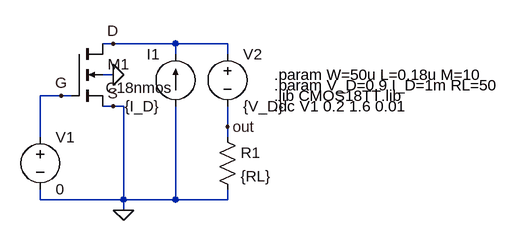
[diagram p0: schematic NMOS-DriveCapability-testbench.asc]
NMOS-DriveCapability-testbench.asc, the LTspice schematic file:
Version 4
SHEET 1 880 680
WIRE 80 48 64 48
WIRE 176 48 80 48
WIRE 256 48 176 48
WIRE 176 64 176 48
WIRE 256 64 256 48
WIRE 80 96 64 96
WIRE 0 128 -32 128
WIRE 16 128 0 128
WIRE 80 144 64 144
WIRE 96 144 80 144
WIRE 256 176 256 144
WIRE -32 192 -32 128
WIRE 256 192 256 176
WIRE -32 288 -32 272
WIRE 96 288 96 144
WIRE 96 288 -32 288
WIRE 176 288 176 144
WIRE 176 288 96 288
WIRE 256 288 256 272
WIRE 256 288 176 288
WIRE 96 304 96 288
FLAG 96 304 0
FLAG 80 96 0
FLAG 0 128 G
FLAG 80 144 S
FLAG 80 48 D
FLAG 256 176 out
SYMBOL nmos4 16 48 R0
WINDOW 3 53 68 Left 2
SYMATTR Value C18nmos
SYMATTR InstName M1
SYMATTR Value2 l={L} w={W} m={M}
SYMBOL voltage -32 176 R0
SYMATTR InstName V1
SYMATTR Value 0
SYMBOL voltage 256 48 R0
SYMATTR InstName V2
SYMATTR Value {V_D}
SYMBOL current 176 144 R180
WINDOW 0 24 80 Left 2
WINDOW 3 24 0 Left 2
SYMATTR InstName I1
SYMATTR Value {I_D}
SYMBOL res 240 176 R0
SYMATTR InstName R1
SYMATTR Value {RL}
TEXT 328 96 Left 2 !.param W=50u L=0.18u M=10
TEXT 328 112 Left 2 !.param V_D=0.9 I_D=1m RL=50
TEXT 328 144 Left 2 !.dc V1 0.2 1.6 0.01
TEXT 328 128 Left 2 !.lib CMOS18TT.lib

The netlist it stands for:
* NMOS-DriveCapability-testbench.asc
M1 D G 0 0 C18nmos l={L} w={W} m={M}
V1 G 0 0
V2 D out {V_D}
I1 0 D {I_D}
R1 out 0 {RL}
.model NMOS NMOS
.model PMOS PMOS
.lib standard.mos
.param W=50u L=0.18u M=10
.param V_D=0.9 I_D=1m RL=50
.dc V1 0.2 1.6 0.01
.lib CMOS18TT.lib
.backanno
.end